# EAGLE design esp8255-full-breakout (EAGLE 9.5.2)
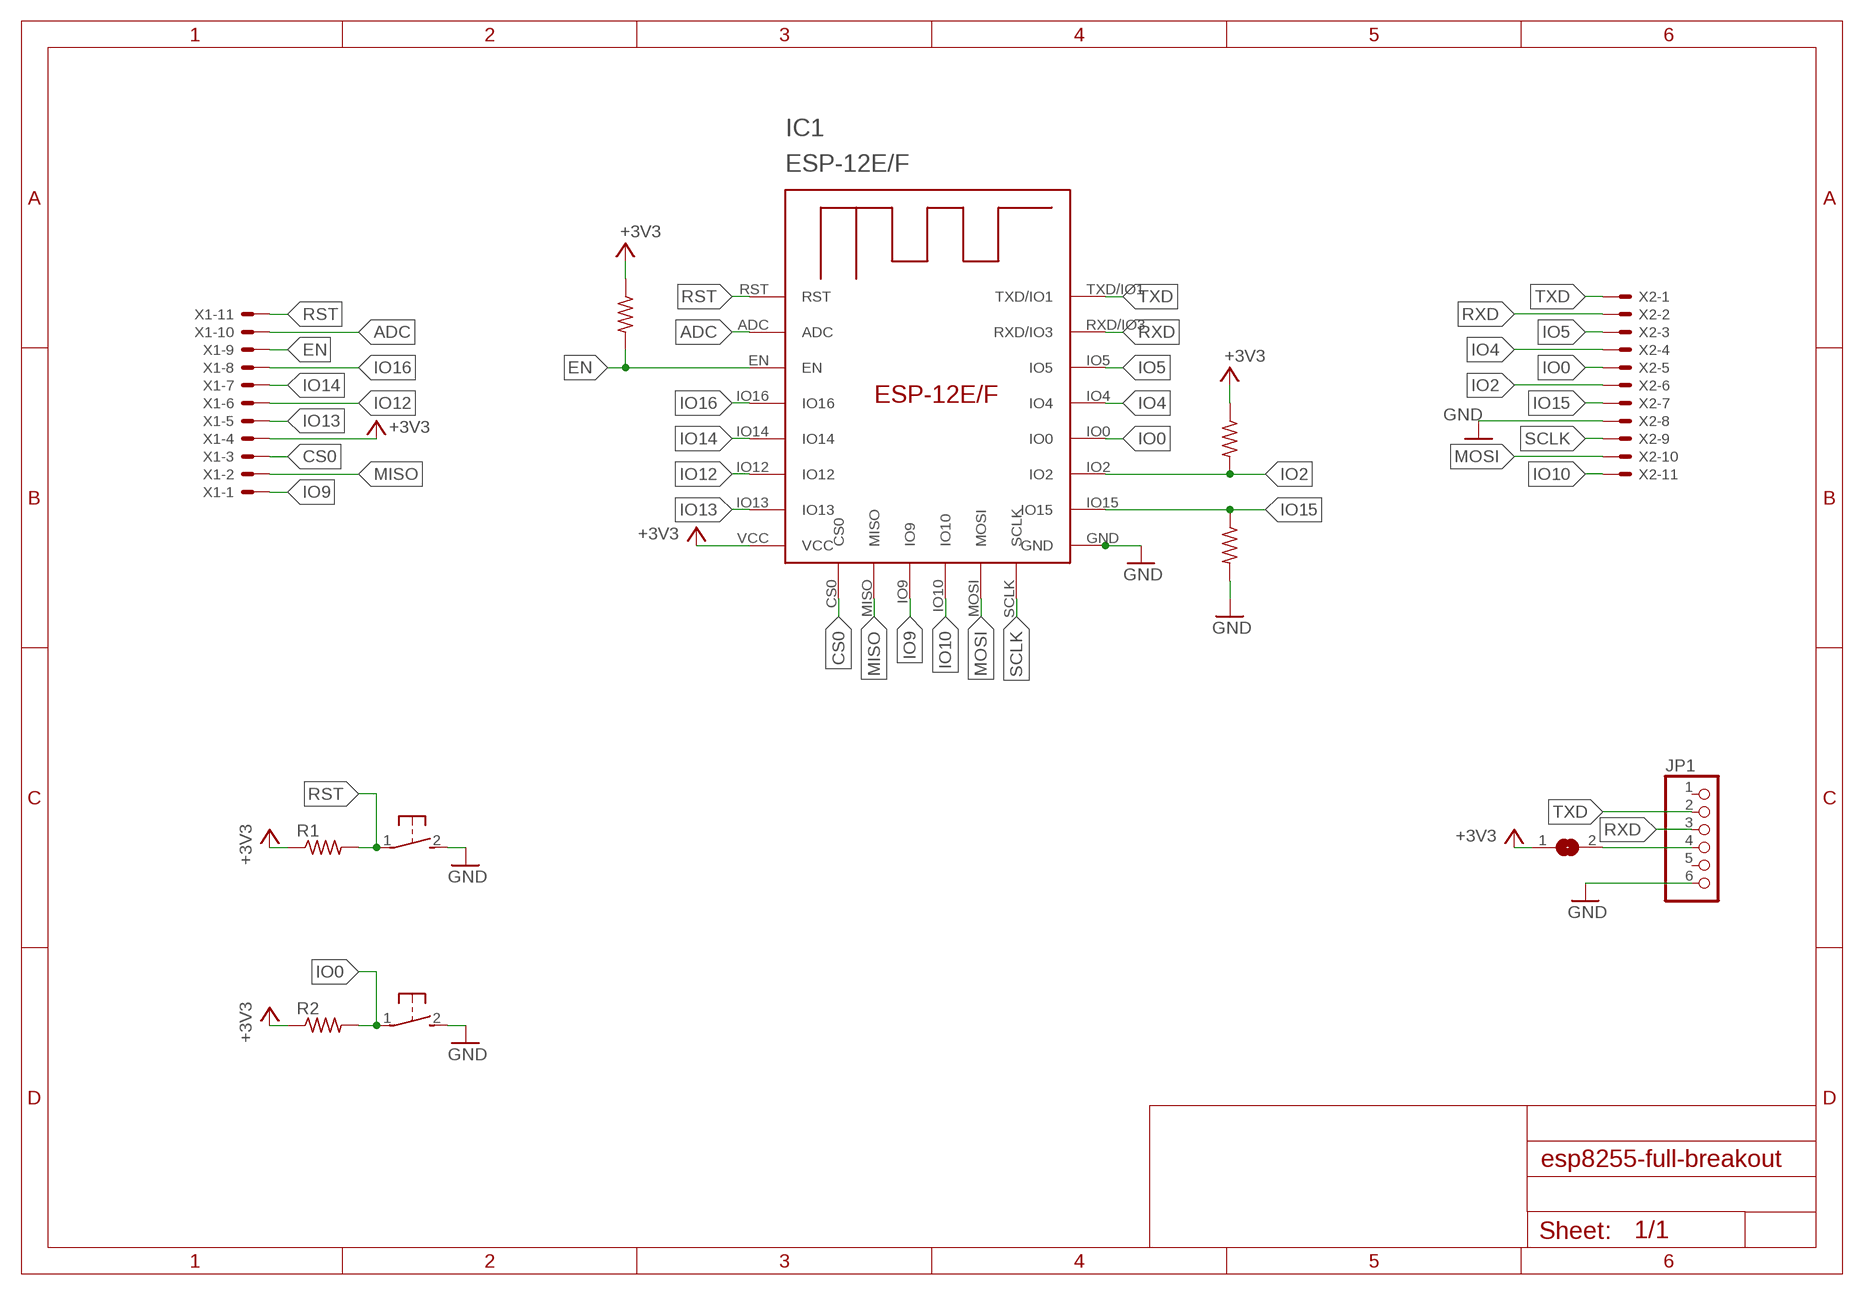
[diagram p0: schematic, sheet 1]

## Parts
IC1  ESP-12E/F  [ESP-12E]
JP1  PINHD-1X6B  [1X06-BIG]
R1  R-US_R1206  [R1206]
R2  R-US_R1206  [R1206]
R3  R-US_R1206  [R1206]
R4  R-US_R1206  [R1206]
R5  R-US_R1206  [R1206]
S1  DTSM-3  [DTSM-3]
S2  DTSM-3  [DTSM-3]
SJ1  SJ  [SJ]
X1  JST-XH-11-PIN-ROUND-PAD  [JST-XH-11-PACKAGE-ROUND-PAD]
X2  JST-XH-11-PIN-ROUND-PAD  [JST-XH-11-PACKAGE-ROUND-PAD]

## Nets
+3V3: IC1.VCC R1.1 R2.1 R4.1 R5.1 SJ1.1 X1.4
ADC: IC1.ADC X1.10
CS0: IC1.CS0 X1.3
EN: IC1.EN R5.2 X1.9
GND: IC1.GND JP1.6 R3.2 S1.2 S2.2 X2.8
IO0: IC1.IO0 R2.2 S2.1 X2.5
IO2: IC1.IO2 R4.2 X2.6
IO4: IC1.IO4 X2.4
IO5: IC1.IO5 X2.3
IO9: IC1.IO9 X1.1
IO10: IC1.IO10 X2.11
IO12: IC1.IO12 X1.6
IO13: IC1.IO13 X1.5
IO14: IC1.IO14 X1.7
IO15: IC1.IO15 R3.1 X2.7
IO16: IC1.IO16 X1.8
MISO: IC1.MISO X1.2
MOSI: IC1.MOSI X2.10
N$1: JP1.4 SJ1.2
RST: IC1.RST R1.2 S1.1 X1.11
RXD: IC1.RXD/IO3 JP1.3 X2.2
SCLK: IC1.SCLK X2.9
TXD: IC1.TXD/IO1 JP1.2 X2.1
Unconnected: JP1.1 JP1.5

## Library data of the parts
IC1 = esp-12e-f:ESP-12E/F
JP1 = adafruit:PINHD-1X6: PIN HEADER
R1-R5 = adafruit:R-US_: RESISTOR, American symbol
S1 S2 = switch-tact:DTSM-3
SJ1 = jumper:SJ: SMD solder JUMPER
X1 X2 = JST-XH:JST-XH-11-PIN: JST XH Connector 2 Pin Wire to board connector. Pitch: 2,54 mm, (0.100") Number of pins: 11 Created by Rembrandt Electronics www.rembrandtelectronics.com

## Board
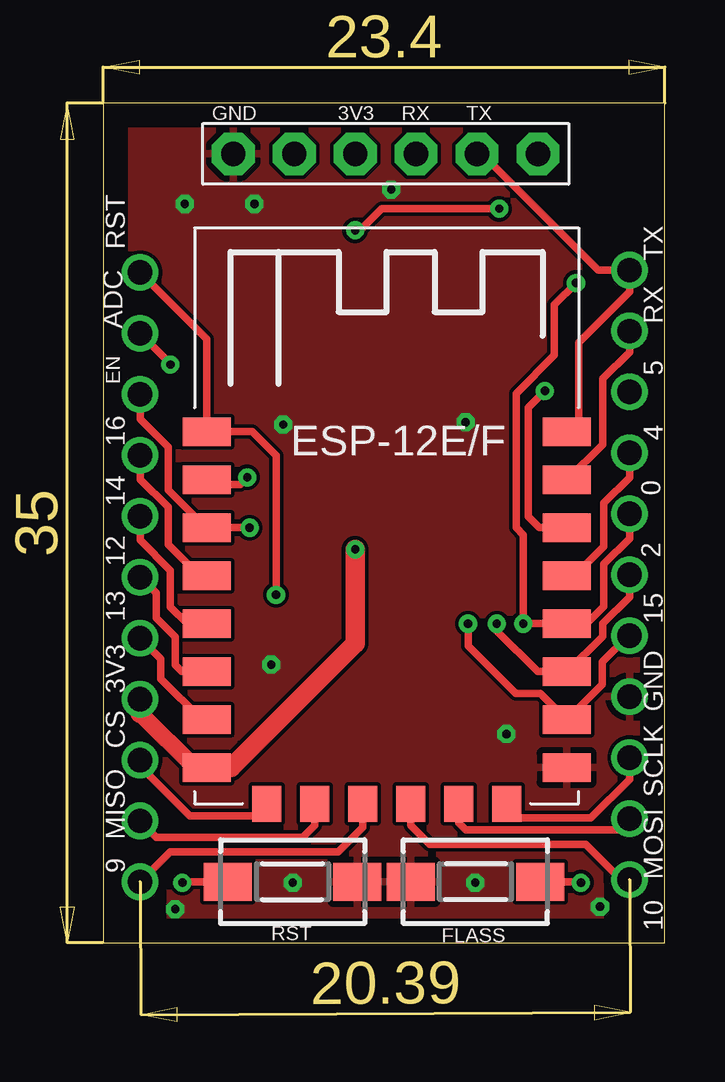
[diagram p1: board, top side]
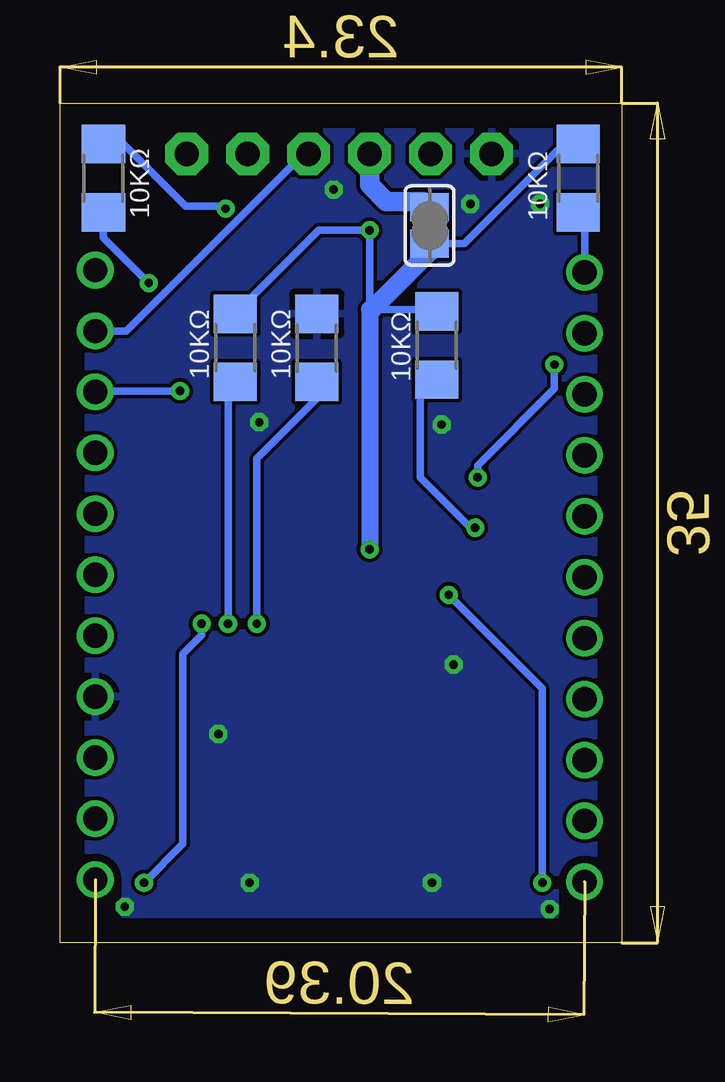
[diagram p2: board, bottom side, seen from below]

Size 23.4 x 35 mm. Coordinates in mm from the lower left corner, seen from the top.
Outline: 0,0 23.4,0 23.4,35 0,35 0,0
Copper layers (1*16): Top 0.035mm / dielectric 1.5mm / Bottom 0.035mm
Design rules "default": minimum track width 6mil, minimum drill 0.35mm, track to track 6mil, track to pad 6mil, pad to pad 6mil, via to via 6mil, smd to smd 6mil, copper to edge 40mil, drill to drill 6mil, minimum pad ring 10mil, minimum via ring 8mil, stop-mask expansion 4mil, vias tented up to drill 0mil, thermal gap 10mil

### Footprints (pad centres in the part's own frame; a part is rotated, then mirrored left to right if it is on the bottom)
ESP-12E = smd 2 x 1.2: ADC -7.46,5.53; EN -7.46,3.53; GND 7.54,-6.47; IO0 7.54,-0.47; IO2 7.54,-2.47; IO4 7.54,1.53; IO5 7.54,3.53; IO12 -7.46,-2.47; IO13 -7.46,-4.47; IO14 -7.46,-0.47; IO15 7.54,-4.47; IO16 -7.46,1.53; RST -7.46,7.53; RXD/IO3 7.54,5.53; TXD/IO1 7.54,7.53; VCC -7.46,-6.47 | smd 1.2 x 1.5: CS0 -4.96,-7.97; IO9 -0.96,-7.97; IO10 1.04,-7.97; MISO -2.96,-7.97; MOSI 3.04,-7.97; SCLK 5.04,-7.97
1X06-BIG = drill 1.016 pad 1.778 octagon: 1 -6.35,0; 2 -3.81,0; 3 -1.27,0; 4 1.27,0; 5 3.81,0; 6 6.35,0
R1206 = smd 1.6 x 1.803: 1 -1.422,0; 2 1.422,0
DTSM-3 = smd 2 x 1.6: 1 -2.7,0; 2 2.7,0
SJ = smd 1.168 x 1.6: 1 -0.762,0; 2 0.762,0
JST-XH-11-PACKAGE-ROUND-PAD = drill 1.016: 1 -12.7,0; 2 -10.16,0; 3 -7.62,0; 4 -5.08,0; 5 -2.54,0; 6 0,0; 7 2.54,0; 8 5.08,0; 9 7.62,0; 10 10.16,0; 11 12.7,0

### Placement (x,y rotation side)
IC1  11.77,13.77 0 top
JP1  11.77,32.89 180 top
R1  1.81,31.87 270 bottom
R2  21.59,31.87 270 bottom
R3  12.7,24.8 90 bottom
R4  16.1,24.8 270 bottom
R5  7.7,24.9 270 bottom
S1  7.89,2.54 0 top
S2  15.51,2.54 180 top
SJ1  8,29.9 90 bottom
X1  1.54,15.24 90 top
X2  21.93,15.34 270 top

### Tracks (layer width: path | path; a pad name or v marks a point on that pad's centre or on a via)
+3V3  (via drill 0.35)
  Top 0.305: v16.5,30.6 11.6,30.6 10.7,29.7 v10.5,29.7
  Top 0.7: 1.54,9.57 3.81,7.3 IC1.VCC
  Top 0.813: IC1.VCC 5.33,7.3 10.5,12.47 v10.5,16.4 | X1.4 1.54,9.57
  Bottom 0.305: R2.1 21.58,33.3 20.76,33.3 18.15,30.7 16.6,30.7 v16.5,30.6 | R5.1 7.78,26.4 10.4,26.4 10.5,26.4 v10.5,29.7 12.62,29.7 R4.1 | SJ1.1 6.56,29.14 2.41,33.29 R1.1
  Bottom 0.7: 10.5,26.4 v10.5,16.4
  Bottom 0.813: SJ1.1 8,28.8 10.4,26.4
ADC  (via drill 0.35)
  Top 0.305: X1.10 2.8,24.14 v2.8,24.1 | v6,19.4 5.7,19.1 4.51,19.1 IC1.ADC
  Bottom 0.305: v2.8,24.1 2.8,23.1 6,19.9 v6,19.4
CS0
  Top 0.305: X1.3 1.54,7.36 3.6,5.3 6.8,5.3 6.81,5.31 IC1.CS0
EN  (via drill 0.35)
  Top 0.305: X1.9 1.54,21.83 2.71,20.66 2.71,18.87 4.28,17.3 IC1.EN v6.1,17.3
  Bottom 0.305: v6.1,17.3 6.3,17.3 8.4,19.4 8.38,19.4 8.38,22.8 R5.2
GND  (via drill 0.35)
  other vias: 7.9,2.5 15.5,2.5 15.1,21.7 7,11.6 16.8,8.7 20.7,1.5 3,1.4 3.4,30.8 12,31.4 7.5,21.6 6.3,30.8
  pour Top: -0.7,34.3 0.5,35.5 22.6,35.5 22.8,35.7 24,34.5 24,0.4 23,-0.6 0.5,-0.6 -0.7,0.6
  pour Bottom: -0.6,34.1 0.8,35.5 22.7,35.5 22.8,35.6 24,34.4 24,0.4 22.9,-0.7 0.6,-0.7 -0.6,0.5
IO0  (via drill 0.35)
  Top 0.305: S2.1 19.86,2.54 v19.9,2.5 | v19.7,27.5 18.8,26.6 18.8,24.5 17.2,22.9 17.2,17.3 17.5,17 v17.5,13.3 IC1.IO0 20.14,13.3 20.86,14.02 20.86,15.78 21.93,16.85 X2.5
  Bottom 0.305: v17.5,13.3 17.5,12.83 18.28,12.04 18.28,4.12 v19.9,2.5 | R2.2 21.59,29.39 v19.7,27.5
IO2  (via drill 0.35)
  Top 0.305: X2.6 21.93,14.41 20.82,13.3 20.82,12.77 19.34,11.3 IC1.IO2 18.1,11.3 16.4,13 v16.4,13.3
  Bottom 0.305: R4.2 16.4,23.08 v16.4,13.3
IO4
  Top 0.305: IC1.IO4 19.64,15.3 20.86,16.52 20.86,18.32 21.93,19.39 X2.4
IO5  (via drill 0.35)
  Top 0.305: IC1.IO5 18.18,17.3 17.7,17.78 17.7,22.3 v18.4,23
  Bottom 0.305: v18.4,23 21.89,23 X2.3
IO9
  Top 0.305: X1.1 2.8,3.8 9.8,3.8 10.81,4.81 IC1.IO9
IO10
  Top 0.305: X2.11 21.56,2.64 20.1,4.1 13.6,4.1 12.81,4.89 IC1.IO10
IO12
  Top 0.305: X1.6 2.2,14.58 2.2,13.55 3,12.74 3,11.57 3.28,11.3 IC1.IO12
IO13
  Top 0.305: X1.5 2.4,11.84 2.4,11 4.1,9.3 IC1.IO13
IO14
  Top 0.305: X1.7 1.54,16.78 2.8,15.52 2.8,14 3.5,13.3 IC1.IO14
IO15  (via drill 0.35)
  Top 0.305: X2.7 21.9,12.8 20.8,11.7 20.8,10.76 19.34,9.3 IC1.IO15 18.21,10.39 17.18,10.39 15.2,12.38 v15.2,13.3
  Bottom 0.305: R3.1 12.7,22.68 15.2,20.18 v15.2,13.3
IO16
  Top 0.305: X1.8 1.54,19.32 2.7,18.16 2.7,16.6 4,15.3 IC1.IO16
MISO
  Top 0.305: X1.2 2.22,4.4 8.31,4.4 8.81,4.9 IC1.MISO
MOSI
  Top 0.305: X2.10 21.45,4.7 15.11,4.7 14.81,5 IC1.MOSI
N$1
  Bottom 0.813: SJ1.2 8.24,30.9 9.8,30.9 10.5,31.6 JP1.4
RST  (via drill 0.35)
  Top 0.305: X1.11 4.31,25.17 IC1.RST 6.2,21.3 7.2,20.3 v7.2,14.5 | S1.1 3.34,2.54 v3.3,2.5
  Bottom 0.305: X1.11 1.54,30.18 R1.2 | v3.3,2.5 3.3,10.6 v7.2,14.5
RXD
  Top 0.305: IC1.RXD/IO3 19.34,19.3 20.82,20.77 20.82,23.52 21.93,24.63 X2.2
  Bottom 0.305: JP1.3 13.24,32.89 20.63,25.5 X2.2
SCLK
  Top 0.305: X2.9 21.93,6.82 20.31,5.2 17.21,5.2 16.81,5.6 IC1.SCLK
TXD
  Top 0.305: IC1.TXD/IO1 19.81,21.8 19.81,25.02 21.93,27.14 X2.1 20.63,28.04 15.78,32.89 JP1.2

### Text on the board
tPlace: GND | 3V3 | RX | TX | TX | RST | RX | ADC | 5 | EN | 4 | 16 | 0 | 14 | 2 | 12 | 15 | 13 | GND | 3V3 | SCLK | CS | MOSI | MISO | 9 | 10 | RST | FLASS
bPlace: 10KΩ | 10KΩ | 10KΩ | 10KΩ | 10KΩ